# EAGLE design gate-argon (EAGLE 9.6.2)
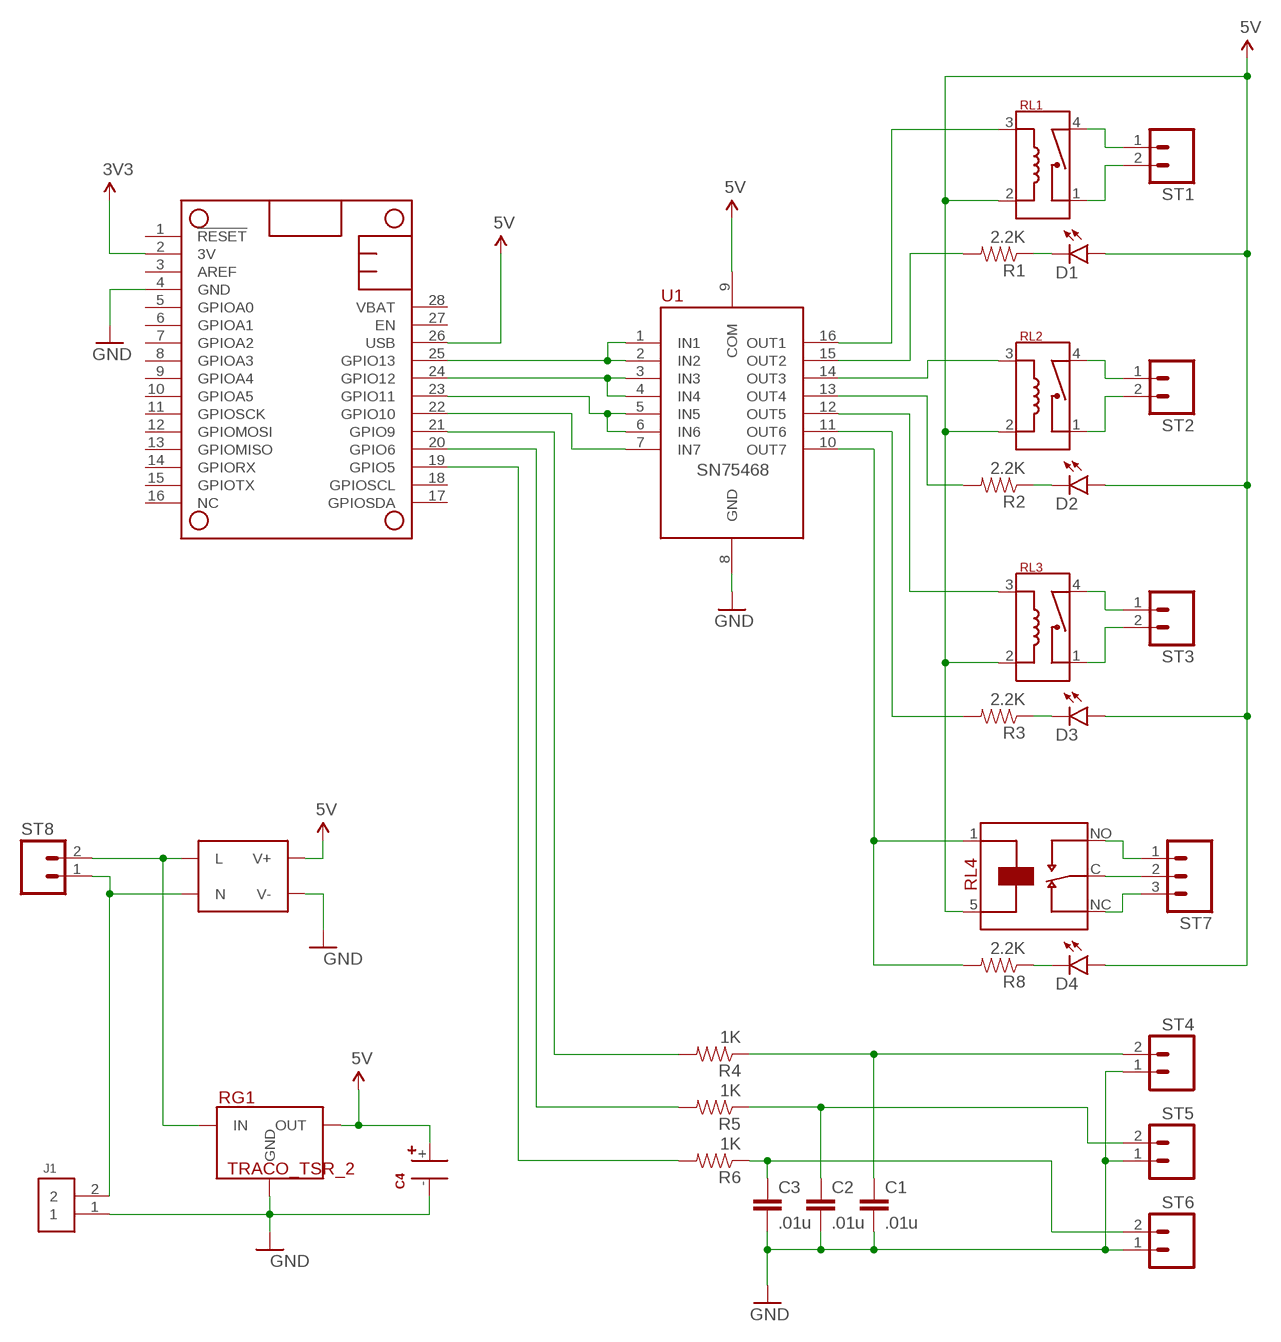
[diagram p0: schematic, sheet 1]

## Parts
C1  .01u  CAP0603-CAP  [0603-CAP]
C2  .01u  CAP0603-CAP  [0603-CAP]
C3  .01u  CAP0603-CAP  [0603-CAP]
C4  CAPACITOR-AXIAL10X25  [CAP-AXIAL-10X25]
D1  LED0603  [LED-0603]
D2  LED0603  [LED-0603]
D3  LED0603  [LED-0603]
D4  LED0603  [LED-0603]
J1  1X21X02-BIG  [1X02-BIG]
MS2  FEATHERWING_NODIM  [FEATHERWING_DIM]
PWR1  IRM_03_PS_3W  [IRM_03_PS_3W]
R1  2.2K  RESISTOR0603  [0603-RES]
R2  2.2K  RESISTOR0603  [0603-RES]
R3  2.2K  RESISTOR0603  [0603-RES]
R4  1K  RESISTOR0603  [0603-RES]
R5  1K  RESISTOR0603  [0603-RES]
R6  1K  RESISTOR0603  [0603-RES]
R8  2.2K  RESISTOR0603  [0603-RES]
RG1  TRACO_TSR_2  [TRACO_TSR_2]
RL1  HE3600_RELAY  [HE3600_RELAY]
RL2  HE3600_RELAY  [HE3600_RELAY]
RL3  HE3600_RELAY  [HE3600_RELAY]
RL4  G2RL_SPDT  [G2RL_SPDT]
ST1  SCREWTERM_2  [SCREWTERM_0.2X2]
ST2  SCREWTERM_2  [SCREWTERM_0.2X2]
ST3  SCREWTERM_2  [SCREWTERM_0.2X2]
ST4  SCREWTERM_2  [SCREWTERM_0.2X2]
ST5  SCREWTERM_2  [SCREWTERM_0.2X2]
ST6  SCREWTERM_2  [SCREWTERM_0.2X2]
ST7  SCREWTERM_3  [SCREWTERM_0.2X3]
ST8  SCREWTERM_2  [SCREWTERM_0.2X2]
U1  SN75468  [SOIC16]

## Nets
3V: MS2.2(3V) ; supply symbol labelled 3V3
5V: C4.+ D1.A D2.A D3.A D4.A MS2.26(USB) PWR1.V+ RG1.3(OUT) RL1.2(R1) RL2.2(R1) RL3.2(R1) RL4.5 U1.9(COM)
GND: C1.2 C2.2 C3.2 C4.- J1.1 MS2.4(GND) PWR1.V- RG1.2(GND) ST4.1 ST5.1 ST6.1 U1.8(GND)
IN: PWR1.ACL(L) RG1.1(IN) ST8.2
L5: RL3.3(R2) U1.12(OUT5)
L6: R3.2 U1.11(OUT6)
L7: R8.2 RL4.1 U1.10(OUT7)
N$1: D2.C R2.1
N$2: RL1.4(C2) ST1.1
N$3: D1.C R1.1
N$4: RL2.4(C2) ST2.1
N$5: R2.2 U1.13(OUT4)
N$6: R1.2 U1.15(OUT2)
N$7: C2.1 R5.1 ST5.2
N$9: RL2.1(C1) ST2.2
N$10: RL3.1(C1) ST3.2
N$11: MS2.22(GPIO10) U1.7(IN7)
N$12: C3.1 R6.1 ST6.2
N$13: RL1.1(C1) ST1.2
N$14: RL3.4(C2) ST3.1
N$15: D3.C R3.1
N$16: MS2.21(GPIO9) R4.2
N$17: MS2.20(GPIO6) R5.2
N$18: MS2.19(GPIO5) R6.2
N$19: MS2.23(GPIO11) U1.5(IN5) U1.6(IN6)
N$20: J1.2 PWR1.ACN(N) ST8.1
N$22: RL2.3(R2) U1.14(OUT3)
N$23: D4.C R8.1
N$26: MS2.25(GPIO13) U1.1(IN1) U1.2(IN2)
N$27: MS2.24(GPIO12) U1.3(IN3) U1.4(IN4)
N$31: C1.1 R4.1 ST4.2
N$33: RL1.3(R2) U1.16(OUT1)
RC: RL4.C ST7.2
RNC: RL4.NC ST7.3
RNO: RL4.NO ST7.1
Unconnected: MS2.1(!RESET) MS2.3(AREF) MS2.5(GPIOA0) MS2.6(GPIOA1) MS2.7(GPIOA2) MS2.8(GPIOA3) MS2.9(GPIOA4) MS2.10(GPIOA5) MS2.11(GPIOSCK) MS2.12(GPIOMOSI) MS2.13(GPIOMISO) MS2.14(GPIORX) MS2.15(GPIOTX) MS2.16(NC) MS2.17(GPIOSDA) MS2.18(GPIOSCL) MS2.27(EN) MS2.28(VBAT)

## Library data of the parts
C1-C3 = SparkFun-Capacitors:CAP: Capacitor Standard 0603 ceramic capacitor, and 0.1" leaded capacitor.
C4 = Puffin:CAPACITOR-AXIAL
D1-D4 = SparkFun-LED:LED: LEDs Standard schematic elements and footprints for 5mm, 3mm, 1206, and 0603 sized LEDs. 5mm - Spark Fun Electronics SKU : COM-00529 (and others)
J1 = Puffin:1X2
MS2 = adafruit:FEATHERWING
PWR1 = Puffin:IRM_03_PS_3W
R1-R6 R8 = SparkFun-Resistors:RESISTOR: Resistor Basic schematic elements and footprints for 0603, 1206, and PTH resistors.
RG1 = Puffin:TRACO_TSR_2
RL1-RL3 = Puffin:HE3600_RELAY
RL4 = Puffin:G2RL_SPDT
ST1-ST6 ST8 = Puffin:SCREWTERM_2
ST7 = Puffin:SCREWTERM_3
U1 = Puffin:SN75468

## Board
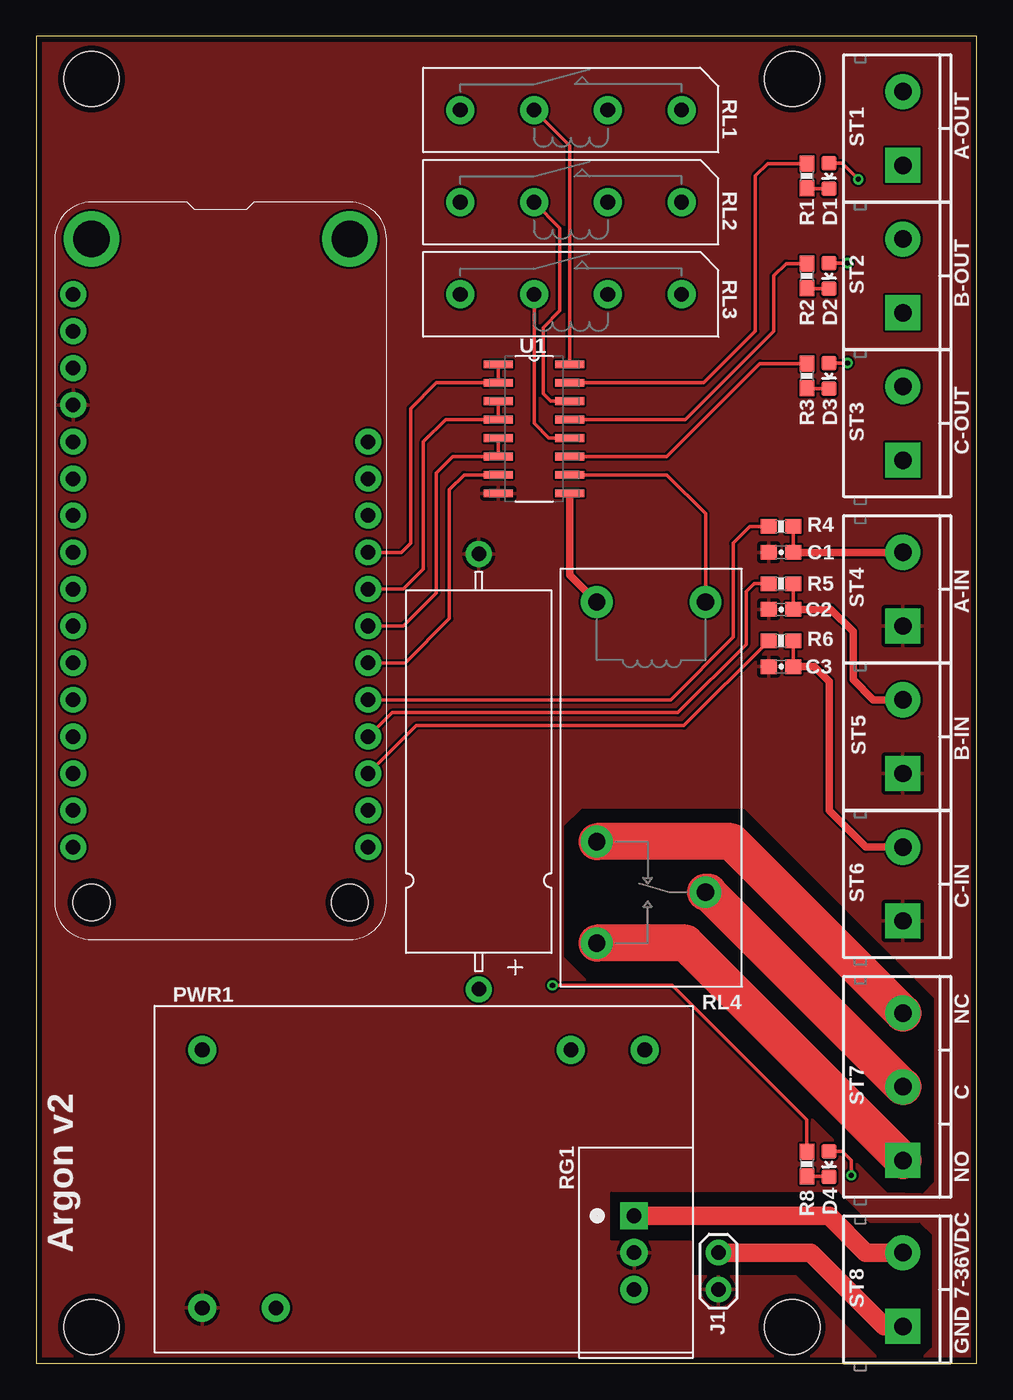
[diagram p1: board, top side]
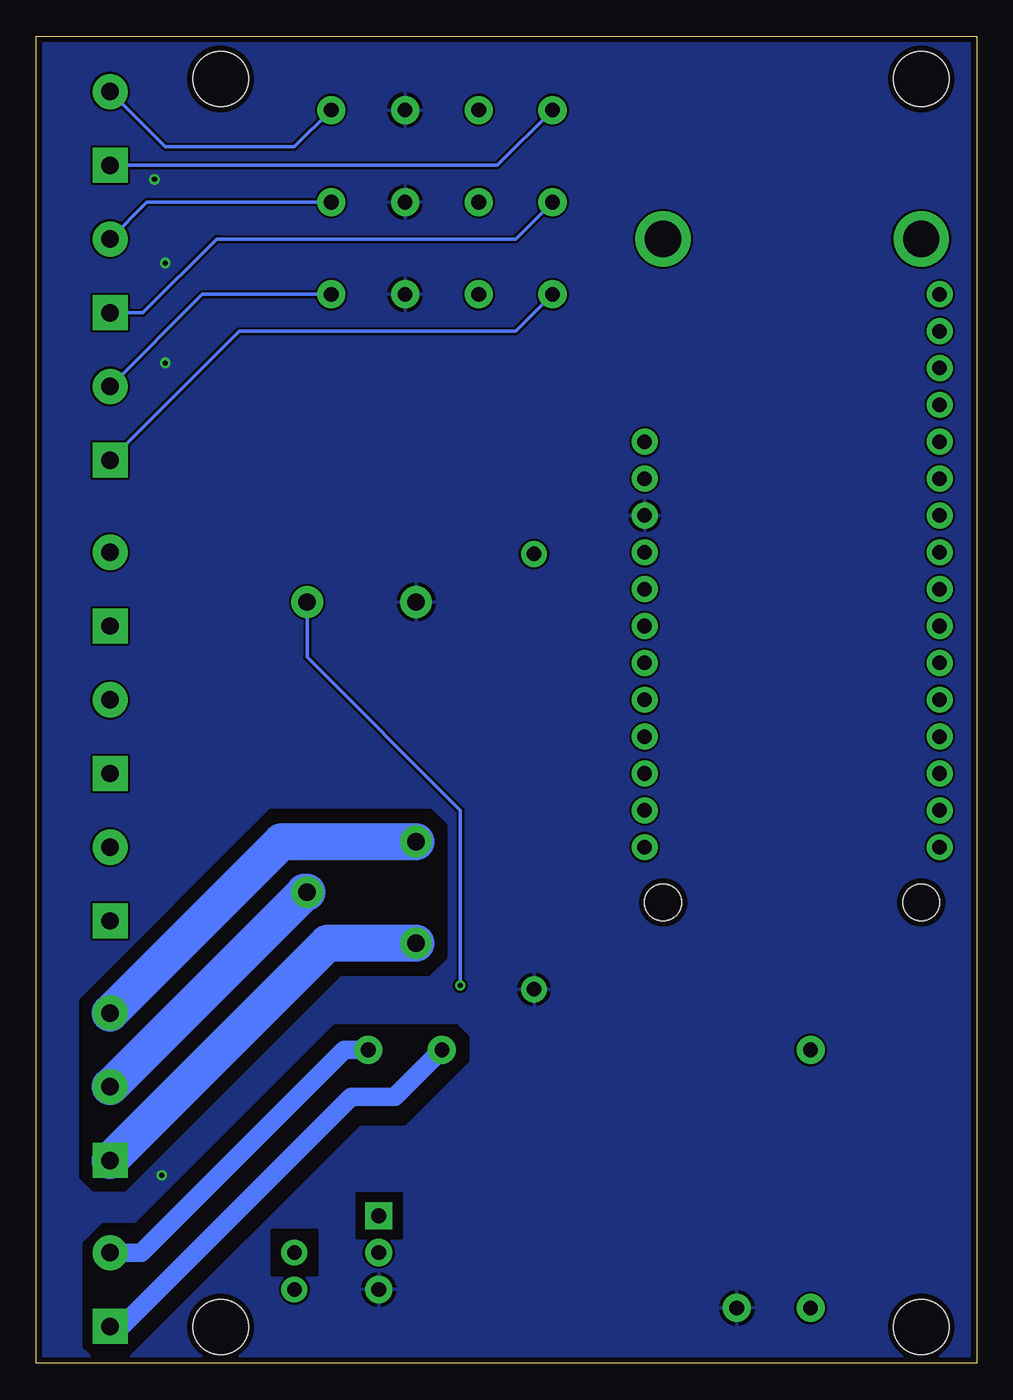
[diagram p2: board, bottom side, seen from below]

Size 64.77 x 91.44 mm. Coordinates in mm from the lower left corner, seen from the top.
Outline: 0,0 64.77,0 64.77,91.44 0,91.44 0,0
Copper layers (1*16): Top 0.0356mm / dielectric 1.5011mm / Bottom 0.0356mm
Design rules "oshpark-2layer": minimum track width 6mil, minimum drill 13mil, track to track 6mil, track to pad 6mil, pad to pad 6mil, via to via 6mil, smd to smd 6mil, copper to edge 15mil, drill to drill 6mil, minimum pad ring 7mil, minimum via ring 7mil, stop-mask expansion 2.5mil, vias tented up to drill 0mil, thermal gap 10mil
Holes 3.81 mm at 3.81,2.5 52.07,2.5 52.07,88.5 3.81,88.5
tRestrict: area 36.5,11.8 to 61.7,38.1; area 39.6,0.5 to 61.6,11.7
bRestrict: area 36.6,11.9 to 61.7,38.1; area 35.1,0.6 to 61.5,23.2; area 39.6,8.6 to 42.7,11.7; area 45.5,6.1 to 48.5,9.1

### Footprints (pad centres in the part's own frame; a part is rotated, then mirrored left to right if it is on the bottom)
0603-CAP = smd 1.1 x 1: 1 -0.85,0; 2 0.85,0
CAP-AXIAL-10X25 = drill 1 pad 1.778: + 15,0; - -15,0
LED-0603 = smd 1 x 1: A 0,-0.877; C 0,0.877
1X02-BIG = drill 1.016 pad 1.778: 1 0,0; 2 2.54,0
FEATHERWING_DIM = drill 1 pad 1.778: 1 6.35,1.27; 2 8.89,1.27; 3 11.43,1.27; 4 13.97,1.27; 5 16.51,1.27; 6 19.05,1.27; 7 21.59,1.27; 8 24.13,1.27; 9 26.67,1.27; 10 29.21,1.27; 11 31.75,1.27; 12 34.29,1.27; 13 36.83,1.27; 14 39.37,1.27; 15 41.91,1.27; 16 44.45,1.27; 17 44.45,21.59; 18 41.91,21.59; 19 39.37,21.59; 20 36.83,21.59; 21 34.29,21.59; 22 31.75,21.59; 23 29.21,21.59; 24 26.67,21.59; 25 24.13,21.59; 26 21.59,21.59; 27 19.05,21.59; 28 16.51,21.59 | drill 2.5 pad 3.81: P$1 2.54,20.32; P$2 2.54,2.54 | hole 2.54: 48.26,20.32; 48.26,2.54
IRM_03_PS_3W = drill 1.016 pad 1.93: ACL 30.48,17.78; ACN 25.4,17.78; NC 0,17.78; V+ 5.08,0; V- 0,0
0603-RES = smd 1.1 x 1: 1 -0.85,0; 2 0.85,0
TRACO_TSR_2 = drill 1.016 pad 1.88 square: 1 -2.54,0 | drill 1.016 pad 1.88: 2 0,0; 3 2.54,0
HE3600_RELAY = drill 1.016 pad 1.93: 1 0,0; 2 0,-5.08; 3 0,-10.16; 4 0,-15.24
G2RL_SPDT = drill 1.2 pad 2.184: 1 -7.5,0; 5 0,0; C -7.5,20; NC 0,16.5; NO 0,23.5
SCREWTERM_0.2X2 = drill 1.2 pad 2.413 square: 1 0,0 | drill 1.2 pad 2.413: 2 5.08,0
SCREWTERM_0.2X3 = drill 1.2 pad 2.413 square: 1 0,0 | drill 1.2 pad 2.413: 2 5.08,0; 3 10.16,0
SOIC16 = smd 1.981 x 0.533: 1 -2.464,4.445; 2 -2.464,3.175; 3 -2.464,1.905; 4 -2.464,0.635; 5 -2.464,-0.635; 6 -2.464,-1.905; 7 -2.464,-3.175; 8 -2.464,-4.445; 9 2.464,-4.445; 10 2.464,-3.175; 11 2.464,-1.905; 12 2.464,-0.635; 13 2.464,0.635; 14 2.464,1.905; 15 2.464,3.175; 16 2.464,4.445

### Placement (x,y rotation side)
C1  51.31,55.88 180 top
C2  51.31,51.94 180 top
C3  51.31,48.01 180 top
C4  30.48,40.77 270 top
D1  54.61,81.82 180 top
D2  54.61,74.93 180 top
D3  54.61,68.04 180 top
D4  54.61,13.72 180 top
J1  46.99,5.08 90 top
MS2  1.27,80.01 270 top
PWR1  11.43,3.81 0 top
R1  53.09,81.82 90 top
R2  53.09,74.93 90 top
R3  53.09,68.04 90 top
R4  51.31,57.66 180 top
R5  51.31,53.72 180 top
R6  51.31,49.78 180 top
R8  53.09,13.72 90 top
RG1  41.18,7.62 270 top
RL1  44.45,86.36 270 top
RL2  44.45,80.01 270 top
RL3  44.45,73.66 270 top
RL4  38.61,52.45 180 top
ST1  59.69,82.55 90 top
ST2  59.69,72.39 90 top
ST3  59.69,62.23 90 top
ST4  59.69,50.8 90 top
ST5  59.69,40.64 90 top
ST6  59.69,30.48 90 top
ST7  59.69,13.97 90 top
ST8  59.69,2.54 90 top
U1  34.29,64.39 0 top

### Tracks (layer width: path | path; a pad name or v marks a point on that pad's centre or on a via)
5V  (via drill 0.35)
  Top 0.254: v55.88,75.82 54.62,75.82 D2.A | D3.A 54.62,68.93 v55.88,68.93 | v56.63,81.58 55.51,82.7 D1.A | D4.A 55.51,14.59 56.13,13.97 v56.13,12.95
  Top 0.508: U1.9 36.75,54.3 RL4.5
  pour Bottom: -1.27,92.71 -1.27,-2.54 68.58,-2.54 68.58,92.71
GND
  pour Top: -0.64,92.71 -0.64,-2.54 65.91,-2.54 65.91,92.71
IN
  Top 1.27: ST8.2 57.15,7.62 54.61,10.16 RG1.1
  Bottom 1.27: ST8.2 57.53,7.62 43.56,21.59 PWR1.ACL
L5
  Top 0.254: RL3.3 34.29,64.77 35.31,63.75 U1.12
L6
  Top 0.254: U1.11 43.43,62.48 49.84,68.89 R3.2
L7  (via drill 0.35)
  Top 0.254: U1.10 43.43,61.21 46.11,58.54 RL4.1 | R8.2 53.09,16.76 43.81,26.04 v35.56,26.04
  Bottom 0.254: v35.56,26.04 35.56,38.1 46.11,48.65 RL4.1
N$1
  Top 0.254: D2.C 53.11,74.05 R2.1
N$2
  Bottom 0.254: ST1.1 33.02,82.55 RL1.4
N$3
  Top 0.254: R1.1 53.11,80.94 D1.C
N$4
  Bottom 0.254: ST2.1 57.42,72.39 52.34,77.47 31.75,77.47 RL2.4
N$5
  Top 0.254: U1.13 44.7,65.02 50.8,71.12 50.8,74.93 51.65,75.78 R2.2
N$6
  Top 0.254: U1.15 45.97,67.56 49.53,71.12 49.53,81.82 50.38,82.67 R1.2
N$7
  Top 0.254: R5.1 52.16,52.07 C2.1
  Top 0.508: ST5.2 57.66,45.72 56.26,47.12 56.26,50.42 54.74,51.94 C2.1
N$9
  Bottom 0.254: RL2.1 57.15,80.01 ST2.2
N$10
  Bottom 0.254: ST3.2 53.34,73.66 RL3.1
N$11
  Top 0.254: MS2.22 25.4,48.26 28.45,51.31 28.45,60.2 29.46,61.21 U1.7
N$12
  Top 0.254: R6.1 C3.1
  Top 0.508: ST6.2 57.15,35.56 54.61,38.1 54.61,46.99 53.59,48.01 C3.1
N$13
  Bottom 0.254: ST1.2 55.88,83.82 46.99,83.82 RL1.1
N$14
  Bottom 0.254: ST3.1 50.8,71.12 31.75,71.12 RL3.4
N$15
  Top 0.254: R3.1 53.11,67.16 D3.C
N$16
  Top 0.254: R4.2 49.15,57.66 48.01,56.52 48.01,50.04 43.69,45.72 MS2.21
N$17
  Top 0.254: R5.2 49.44,53.72 48.9,53.17 48.9,49.53 44.2,44.83 24.51,44.83 MS2.20
N$18
  Top 0.254: R6.2 44.62,43.94 26.16,43.94 MS2.19
N$19
  Top 0.254: MS2.23 25.27,50.8 27.56,53.09 27.56,61.34 28.7,62.48 U1.6 U1.5
N$20
  Top 1.27: J1.2 53.34,7.62 58.42,2.54 ST8.1
  Bottom 1.27: ST8.1 58.9,2.54 43.08,18.35 40.07,18.35 PWR1.ACN
N$22
  Top 0.254: U1.14 35.43,66.29 34.92,66.8 34.92,71.37 36.07,72.52 36.07,78.23 RL2.3
N$23
  Top 0.254: R8.1 54.58,12.87 D4.C
N$26
  Top 0.254: U1.1 U1.2 27.56,67.56 25.78,65.79 25.78,56.52 25.15,55.88 MS2.25
N$27
  Top 0.254: MS2.24 25.27,53.34 26.67,54.74 26.67,63.5 28.19,65.02 U1.4 U1.3
N$31
  Top 0.254: R4.1 C1.1
  Top 0.508: C1.1 ST4.2
N$33
  Top 0.254: U1.16 36.75,83.9 RL1.3
RC
  Top 2.54: ST7.2 46.29,32.45 RL4.C
  Bottom 2.54: RL4.C 46.29,32.45 ST7.2
RNC
  Top 2.54: ST7.3 47.87,35.95 RL4.NC
  Bottom 2.54: ST7.3 47.87,35.95 RL4.NC
RNO
  Top 2.54: ST7.1 44.71,28.95 RL4.NO
  Bottom 2.54: RL4.NO 44.71,28.95 ST7.1

### Text on the board
tPlace: A-OUT | B-OUT | C-OUT | A-IN | B-IN | C-IN | NC | C | NO | Argon v2 | 7-36VDC | GND